# Altium schematic sheet BMA180.SchDoc: BMA180
size Letter
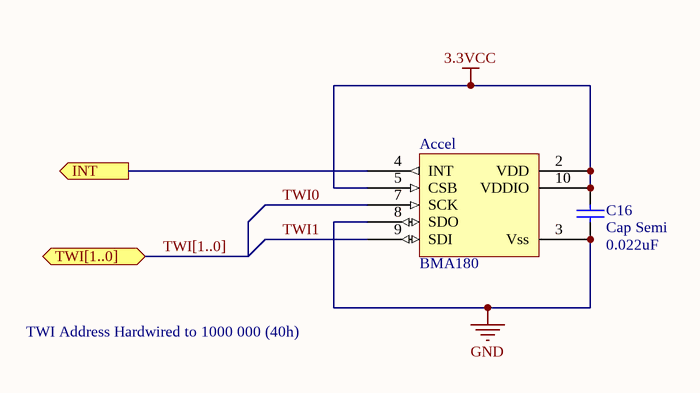
[diagram p0: BMA180.SchDoc]

## Parts
Accel  BMA180  [BMA180 - ECESHOP]
C16  Cap Semi  value 0.022uF  [CAPC2012N]

## Ports
INT (out), TWI[1..0] (bidir)

## Nets
3.3VCC: Accel.2(VDD) Accel.5(CSB) Accel.10(VDDIO) C16.2
GND: Accel.3(Vss) Accel.8(SDO) C16.1
INT: Accel.4(INT) ; port INT
TWI0: Accel.7(SCK)
TWI1: Accel.9(SDI)

## Buses and harness runs
bus TWI[1..0] = port TWI[1..0]

## Notes on the sheet
- TWI Address Hardwired to 1000 000 (40h)
- Title
- Size:
- Date:
- Letter
- Number:
- Time:
- Revision:
- Sheet
- of
- File:

## Library data of the parts
C16 = Cap Semi: Capacitor (Semiconductor SIM Model); Published: 8-Jun-2000; LatestRevisionDate: 29-May-2009; LatestRevisionNote: IPC-7351 Footprint Added.; PackageReference: C1206; Publisher: Altium Limited; PackageDescription: Chip Capacitor